# Altium schematic sheet BME280.SchDoc
size A4; SheetNumber: 5; SheetTotal: 6
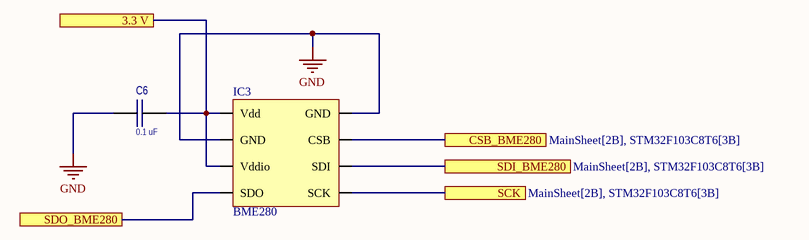
[diagram p0: BME280.SchDoc]

## Parts
C6  0.1 uF  [C_0805]
IC3  BME280  [BME280]

## Ports
3.3 V (see MainSheet[1A], DC-DC_MC34063[1B], DS18B20[2C], STM32F103C8T6[1C], TH02[1B]), CSB_BME280 (see MainSheet[2B], STM32F103C8T6[3B]), SCK (see MainSheet[2B], STM32F103C8T6[3B]), SDI_BME280 (see MainSheet[2B], STM32F103C8T6[3B]), SDO_BME280 (see MainSheet[2B], STM32F103C8T6[3B])

## Nets
GND: C6.2 IC3.1(GND) IC3.7(GND)
3.3 V: C6.1 IC3.6(Vddio) IC3.8(Vdd) ; port 3.3 V
CSB_BME280: IC3.2(CSB) ; port CSB_BME280
SCK: IC3.4(SCK) ; port SCK
SDI_BME280: IC3.3(SDI) ; port SDI_BME280
SDO_BME280: IC3.5(SDO) ; port SDO_BME280

## Library data of the parts
C6 = C0805: Capacitor; Value: 0.1 uF